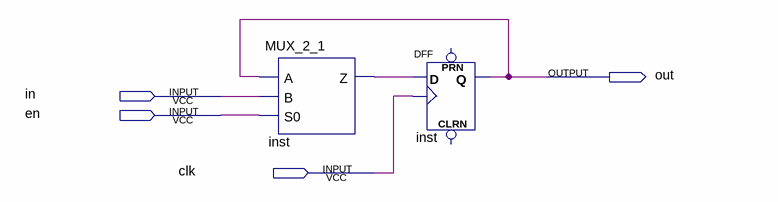
[diagram p0: schematic sheet]
// Quartus schematic flag.bdf as structural Verilog: 2 symbols, 4 pins
module flag (
  input  in,
  input  en,
  input  clk,
  output out
);

  wire inst_z;

  MUX_2_1 inst (.A(out), .B(in), .S0(en), .Z(inst_z));
  DFF inst_dup2 (.CLK(clk), .D(inst_z), .Q(out));  // open: CLRN, PRN
endmodule
